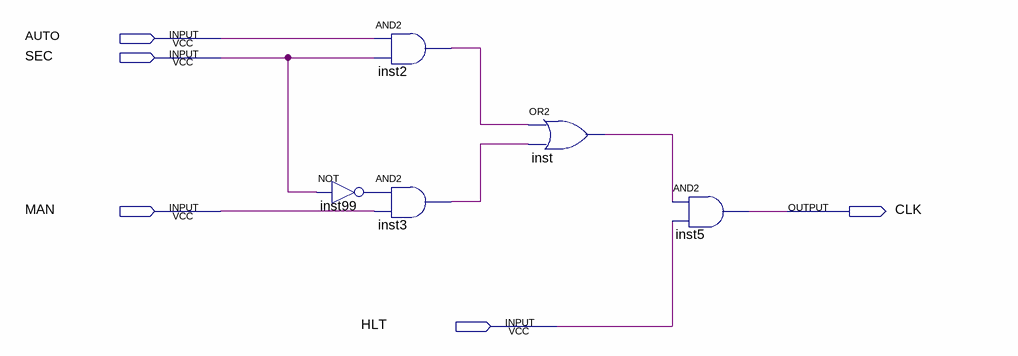
[diagram p0: schematic sheet]
// Quartus schematic Clock_Controller.bdf as structural Verilog: 5 symbols, 5 pins
module Clock_Controller (
  input  AUTO,
  input  SEC,
  input  MAN,
  input  HLT,
  output CLK
);

  wire inst2_out, inst3_out, inst99_out, inst_out;

  not inst99 (inst99_out, SEC);
  and inst2 (inst2_out, AUTO, SEC);
  and inst3 (inst3_out, inst99_out, MAN);
  or inst (inst_out, inst2_out, inst3_out);
  and inst5 (CLK, inst_out, HLT);
endmodule
